# EAGLE design Shield Arduino Drone 1 (EAGLE 9.5.2)
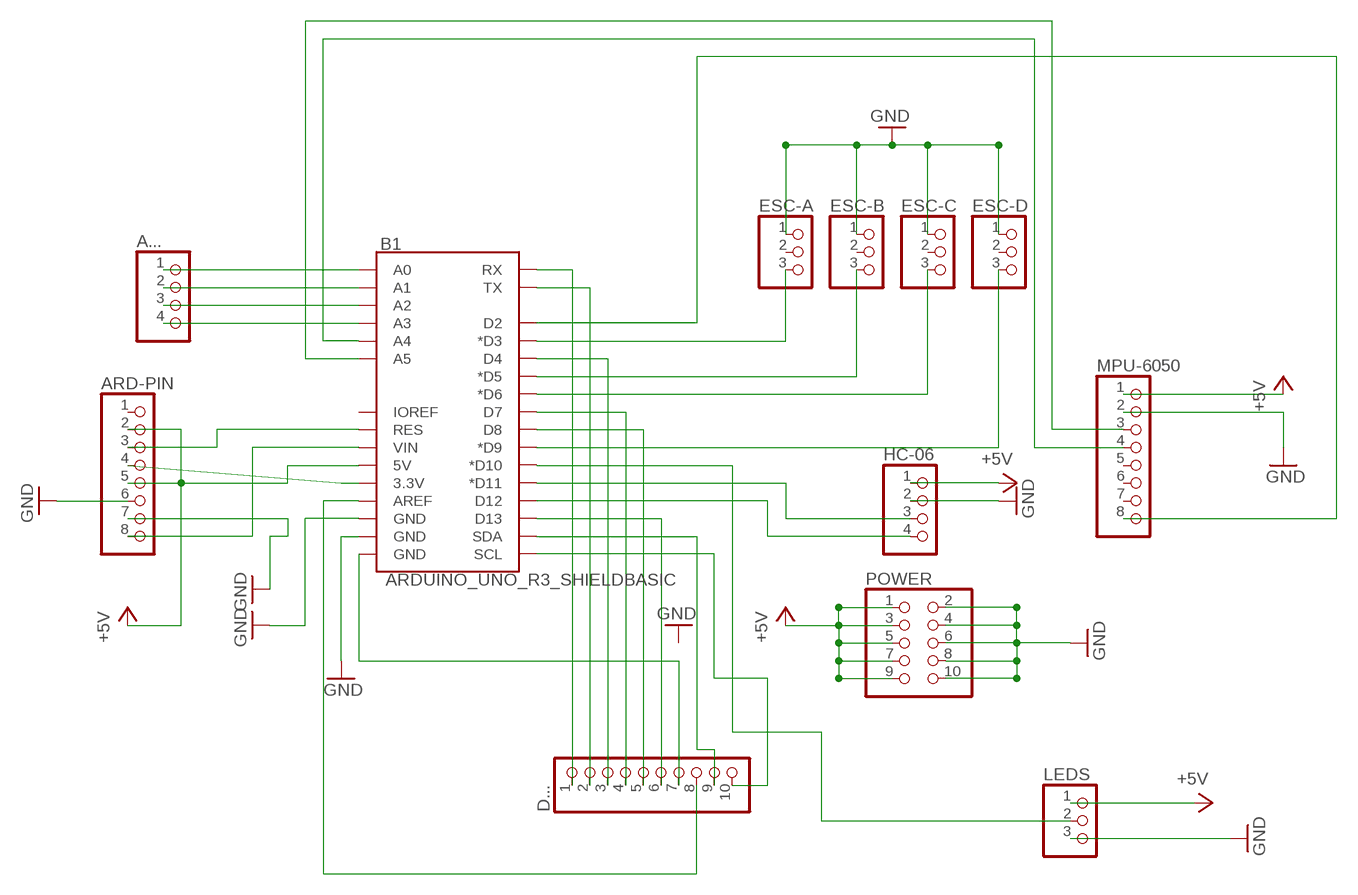
[diagram p0: schematic, sheet 1]

## Parts
A...  PINHD-1X4  [1X04]
ARD-PIN  PINHD-1X8  [1X08]
B1  ARDUINO_UNO_R3_SHIELDBASIC  [UNO_R3_SHIELD]
D...  PINHD-1X10  [1X10]
ESC-A  PINHD-1X3  [1X03]
ESC-B  PINHD-1X3  [1X03]
ESC-C  PINHD-1X3  [1X03]
ESC-D  PINHD-1X3  [1X03]
HC-06  PINHD-1X4  [1X04]
LEDS  PINHD-1X3  [1X03]
MPU-6050  PINHD-1X8  [1X08]
POWER  PINHD-2X5  [2X05]

## Nets
+5V [Power]: ARD-PIN.2 ARD-PIN.5 B1.5V HC-06.1 LEDS.1 MPU-6050.1 POWER.1 POWER.3 POWER.5 POWER.7 POWER.9
GND [Power]: ARD-PIN.6 ARD-PIN.7 B1.GND@1(GND) B1.GND@2(GND) ESC-A.1 ESC-B.1 ESC-C.1 ESC-D.1 HC-06.2 LEDS.3 MPU-6050.2 POWER.2 POWER.4 POWER.6 POWER.8 POWER.10
N$1: B1.A5 MPU-6050.3
N$2: B1.A4 MPU-6050.4
N$3: B1.D2 MPU-6050.8
N$4: B1.D11(*D11) HC-06.3
N$5: B1.D12 HC-06.4
N$6: A....1 B1.A0
N$7: A....2 B1.A1
N$8: A....3 B1.A2
N$9: A....4 B1.A3
N$10: ARD-PIN.8 B1.VIN
N$11: ARD-PIN.3 B1.RES
N$12: B1.D13 D....6
N$13: B1.RX D....1
N$15: ARD-PIN.4 B1.3.3V
N$16: B1.TX D....2
N$17: B1.D3(*D3) ESC-A.3
N$18: B1.D4 D....3
N$19: B1.D5(*D5) ESC-B.3
N$20: B1.D6(*D6) ESC-C.3
N$21: B1.D7 D....4
N$22: B1.D8 D....5
N$23: B1.D9(*D9) ESC-D.3
N$24: B1.D10(*D10) LEDS.2
N$25: B1.AREF D....8
N$26: B1.SDA D....9
N$27: B1.SCL D....10
N$29: B1.GND@0(GND) D....7
Unconnected: ARD-PIN.1 B1.IOREF ESC-A.2 ESC-B.2 ESC-C.2 ESC-D.2 MPU-6050.5 MPU-6050.6 MPU-6050.7

## Library data of the parts
A... HC-06 = pinhead:PINHD-1X4: PIN HEADER
ARD-PIN MPU-6050 = pinhead:PINHD-1X8: PIN HEADER
B1 = SparkFun-Boards:ARDUINO_UNO_R3_SHIELD: Arduino R3 Shield Footprint Shield form compatible with the Arduino Uno R3. SparkFun Products: MG2639 Cellular Shield <https://www.sparkfun.com/products/13120> MIDI Shield <https://www.sparkfun.com/products/12898> R3 Stackable Headers Kit <https://www.sparkfun.com/products/11417>
D... = pinhead:PINHD-1X10: PIN HEADER
ESC-A ESC-B ESC-C ESC-D LEDS = pinhead:PINHD-1X3: PIN HEADER
POWER = pinhead:PINHD-2X5: PIN HEADER

## Net classes
0 default: width 0.305 mm, drill 0.254 mm
1 Power: width 0.762 mm, drill 0.305 mm

## Board
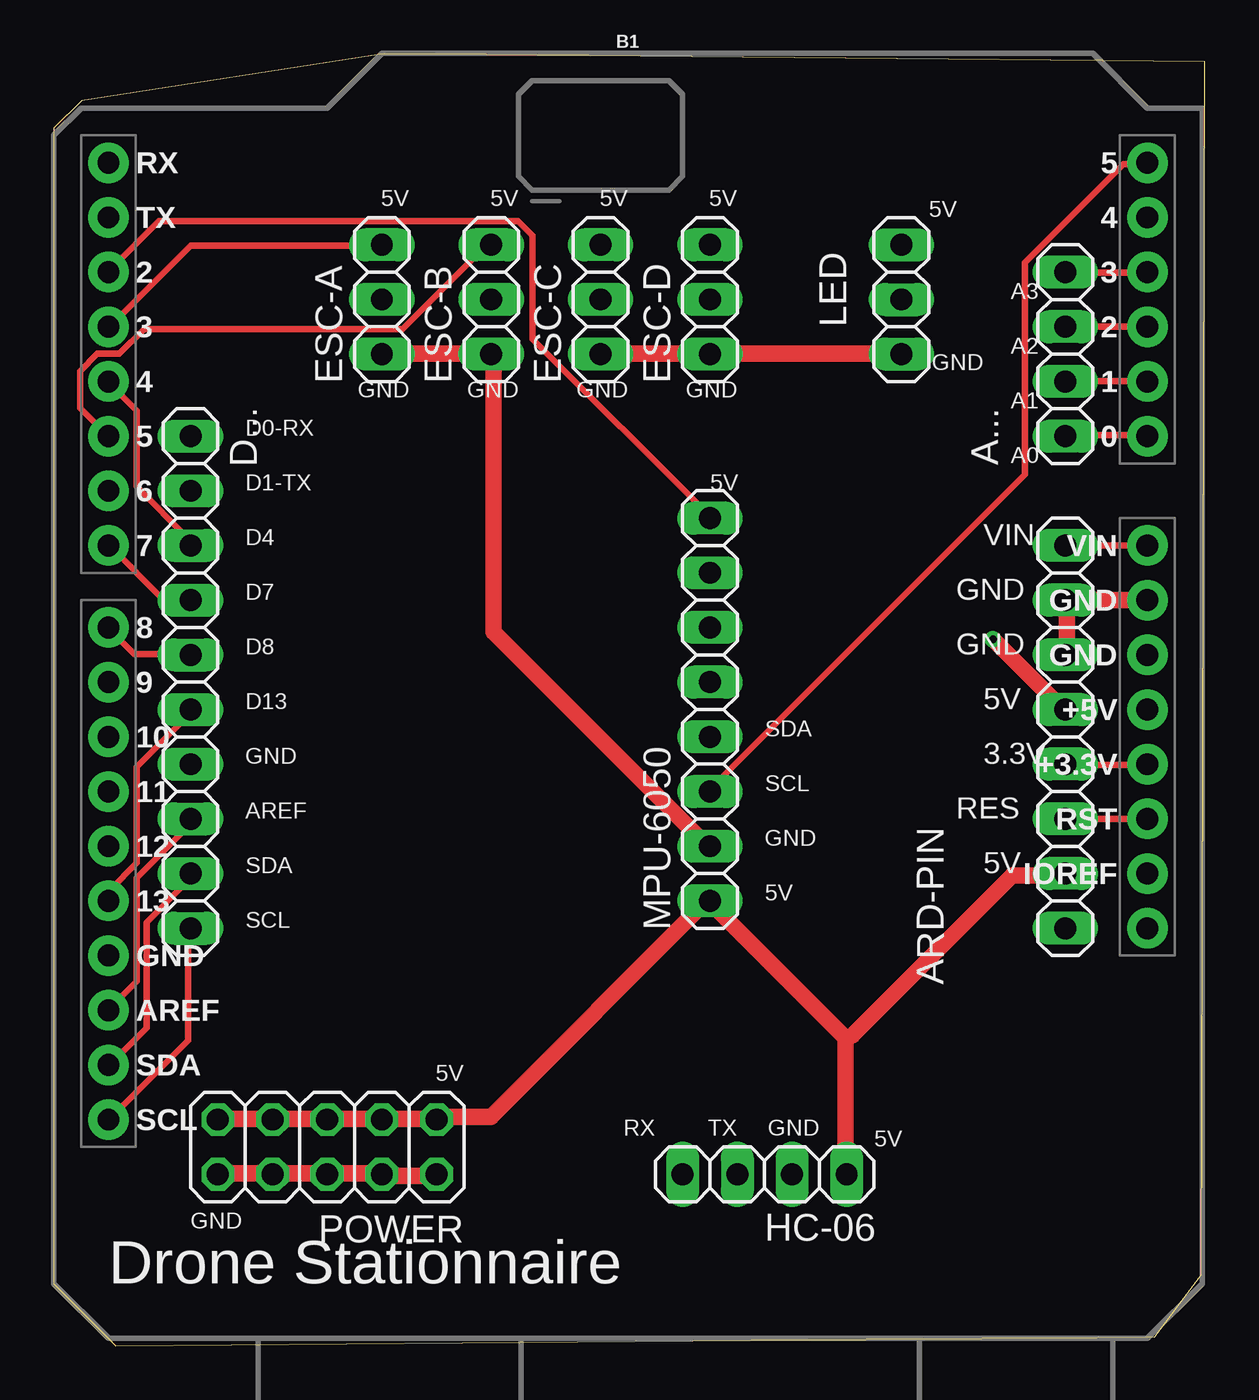
[diagram p1: board, top side]
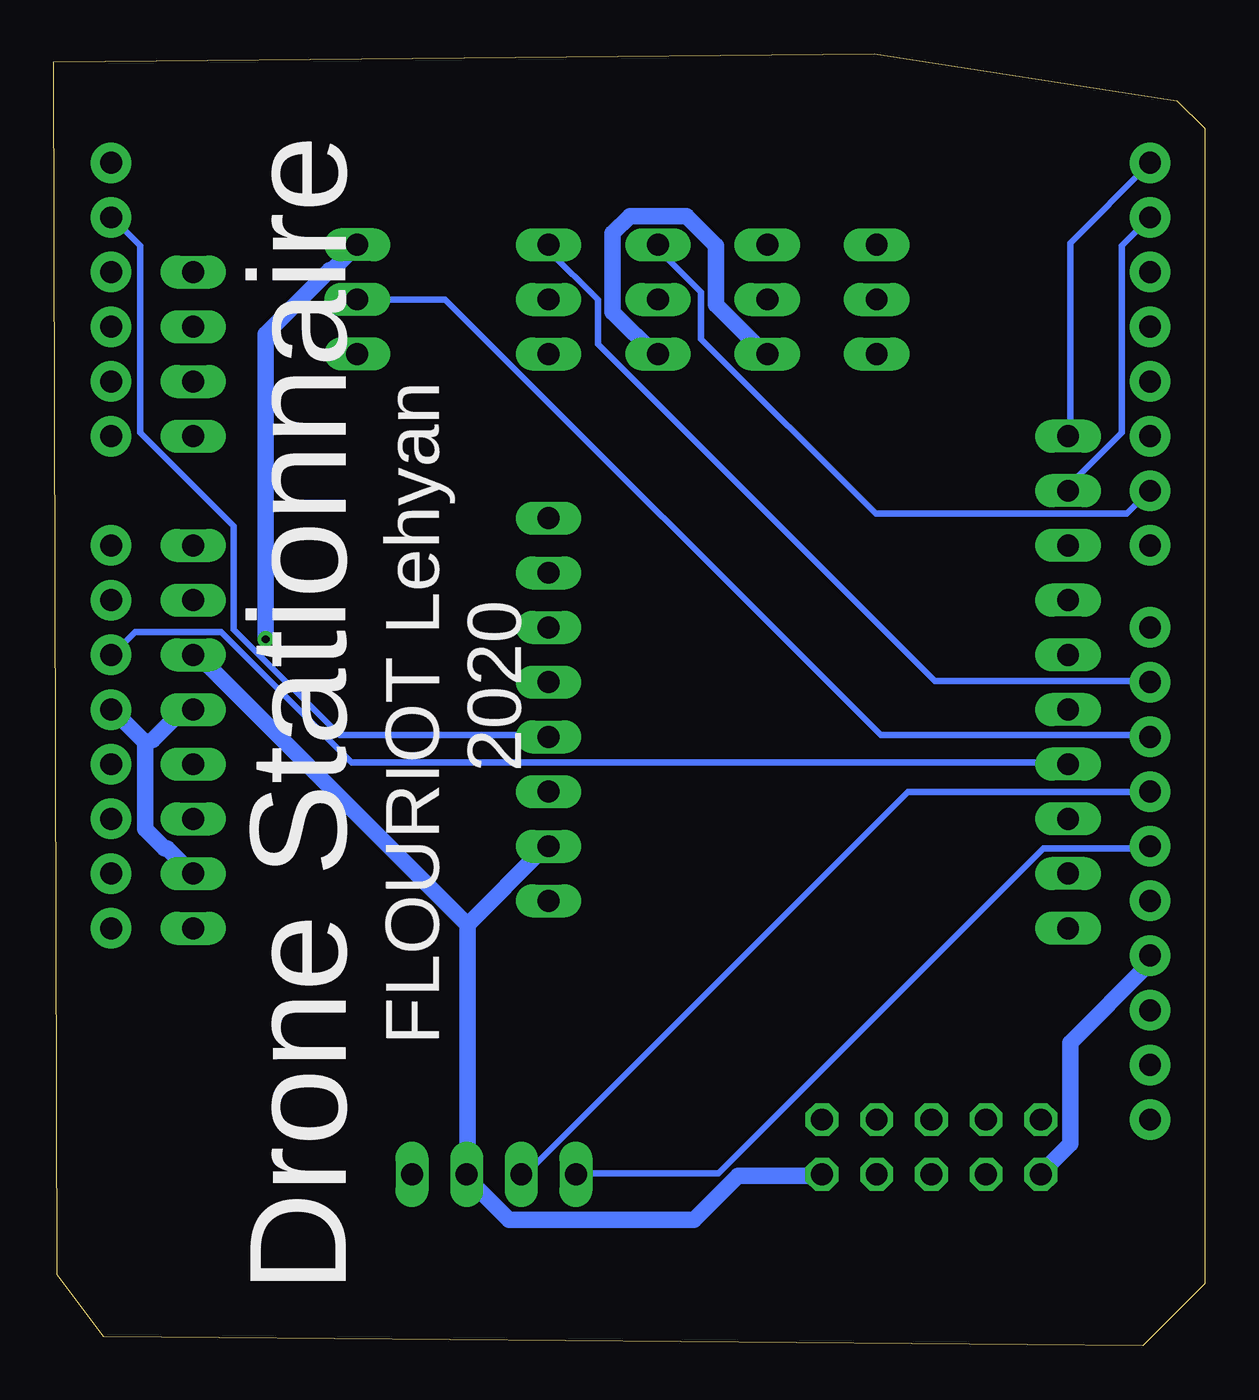
[diagram p2: board, bottom side, seen from below]

Size 53.47 x 60.01 mm. Coordinates in mm from the lower left corner, seen from the top.
Outline: 0,56.55 0,2.88 2.88,0 51.14,0.41 53.3,3.3 53.46,59.64 15.35,60.01 1.29,57.82 0,56.55
Copper layers (1*16): Top 0.035mm / dielectric 1.5mm / Bottom 0.035mm
Design rules "default": minimum track width 6mil, minimum drill 0.35mm, track to track 6mil, track to pad 6mil, pad to pad 6mil, via to via 6mil, smd to smd 6mil, copper to edge 40mil, drill to drill 6mil, minimum pad ring 10mil, minimum via ring 8mil, stop-mask expansion 4mil, vias tented up to drill 0mil, thermal gap 10mil

### Footprints (pad centres in the part's own frame; a part is rotated, then mirrored left to right if it is on the bottom)
1X04 = drill 1.016 long: 1 -3.81,0; 2 -1.27,0; 3 1.27,0; 4 3.81,0
1X08 = drill 1.016 long: 1 -8.89,0; 2 -6.35,0; 3 -3.81,0; 4 -1.27,0; 5 1.27,0; 6 3.81,0; 7 6.35,0; 8 8.89,0
UNO_R3_SHIELD = drill 1.016 pad 1.88: 3.3V 24.13,-2.54; 5V 24.13,0; A0 24.13,12.7; A1 24.13,15.24; A2 24.13,17.78; A3 24.13,20.32; A4 24.13,22.86; A5 24.13,25.4; AREF -24.13,-13.97; D2 -24.13,20.32; D3 -24.13,17.78; D4 -24.13,15.24; D5 -24.13,12.7; D6 -24.13,10.16; D7 -24.13,7.62; D8 -24.13,3.81; D9 -24.13,1.27; D10 -24.13,-1.27; D11 -24.13,-3.81; D12 -24.13,-6.35; D13 -24.13,-8.89; GND@0 24.13,2.54; GND@1 24.13,5.08; GND@2 -24.13,-11.43; IOREF 24.13,-7.62; NC 24.13,-10.16; RES 24.13,-5.08; RX -24.13,25.4; SCL -24.13,-19.05; SDA -24.13,-16.51; TX -24.13,22.86; VIN 24.13,7.62
1X10 = drill 1.016 long: 1 -11.43,0; 2 -8.89,0; 3 -6.35,0; 4 -3.81,0; 5 -1.27,0; 6 1.27,0; 7 3.81,0; 8 6.35,0; 9 8.89,0; 10 11.43,0
1X03 = drill 1.016 long: 1 -2.54,0; 2 0,0; 3 2.54,0
2X05 = drill 1.016 octagon: 1 -5.08,-1.27; 2 -5.08,1.27; 3 -2.54,-1.27; 4 -2.54,1.27; 5 0,-1.27; 6 0,1.27; 7 2.54,-1.27; 8 2.54,1.27; 9 5.08,-1.27; 10 5.08,1.27

### Placement (x,y rotation side)
A...  46.99,46.06 90 top
ARD-PIN  46.99,28.28 90 top
B1  26.67,29.55 0 top
D...  6.35,30.82 270 top
ESC-A  15.24,48.6 90 top
ESC-B  20.32,48.6 90 top
ESC-C  25.4,48.6 90 top
ESC-D  30.48,48.6 90 top
HC-06  33.02,7.96 180 top
LEDS  39.37,48.6 270 top
MPU-6050  30.48,29.55 90 top
POWER  12.7,9.23 180 top

### Tracks (layer width: path | path; a pad name or v marks a point on that pad's centre or on a via)
+5V  (via drill 0.35)
  Top 0.762: v43.62,32.82 46.94,29.5 ARD-PIN.5 | POWER.9 7.62,10.53 10.13,10.53 POWER.7 10.48,10.53 12.65,10.53 POWER.5 12.99,10.53 15.16,10.53 POWER.3 15.62,10.53 17.68,10.53 POWER.1 18.14,10.64 20.31,10.64 30.14,20.47 MPU-6050.1 30.48,20.59 36.77,14.3 | 36.77,14.3 36.77,8.01 HC-06.1 | ARD-PIN.2 46.94,21.84 44.54,21.84 37.11,14.41 36.77,14.3
  Bottom 0.762: 49.23,28.01 49.23,24.01 48.31,23.1 48.2,23.1 47.05,21.96 ARD-PIN.2 | 49.23,28.01 50.71,29.5 B1.5V | ARD-PIN.5 47.05,29.5 47.51,29.5 48.88,28.13 49.23,28.01 | v43.62,32.82 43.62,46.99 40.65,49.96 40.54,49.96 39.39,51.1 LEDS.1
GND
  Top 0.762: ESC-A.1 15.28,46.07 20.31,46.07 ESC-B.1 20.42,45.73 20.42,33.16 30.48,23.1 MPU-6050.2 | ESC-C.1 25.45,46.07 30.48,46.07 ESC-D.1 30.82,46.07 39.28,46.07 LEDS.3 | POWER.10 7.62,8.01 10.13,8.01 POWER.8 10.48,8.01 12.65,8.01 POWER.6 12.99,8.01 15.16,8.01 POWER.4 15.62,7.9 17.68,7.9 POWER.2 | ARD-PIN.6 47.05,32.13 47.05,34.53 ARD-PIN.7 47.4,34.64 50.71,34.64 B1.GND@1
  Bottom 0.762: ESC-B.1 20.42,46.07 22.71,48.36 22.71,51.1 24.08,52.48 26.71,52.48 27.51,51.67 27.51,48.02 25.45,45.96 ESC-C.1 | B1.GND@2 2.59,18.07 2.59,17.73 6.25,14.07 6.25,9.38 7.62,8.01 POWER.10 | 34.25,19.56 34.25,8.01 HC-06.2 34.14,7.67 32.31,5.84 23.74,5.84 21.68,7.9 17.79,7.9 POWER.2 | 34.25,19.56 30.71,23.1 30.48,23.1 MPU-6050.2 | 34.25,19.56 46.71,32.02 46.94,32.02 ARD-PIN.6
N$1
  Top 0.305: MPU-6050.3 30.48,25.84 45.11,40.47 45.11,50.3 49.68,54.88 50.71,54.88 B1.A5
N$2
  Bottom 0.305: MPU-6050.4 30.48,28.36 40.2,28.36 45.11,33.27 45.11,38.07 49.45,42.42 49.45,51.1 50.71,52.36 B1.A4
N$3
  Top 0.305: MPU-6050.8 30.48,38.53 22.25,46.76 22.25,51.56 21.56,52.25 4.88,52.25 2.59,49.96 B1.D2
N$4
  Bottom 0.305: HC-06.3 31.74,8.01 31.51,8.01 13.79,25.73 2.59,25.73 B1.D11
N$5
  Bottom 0.305: HC-06.4 29.11,8.01 22.59,8.01 7.51,23.1 2.59,23.1 B1.D12
N$6
  Top 0.305: A....1 47.05,42.3 50.71,42.3 B1.A0
N$7
  Top 0.305: A....2 47.05,44.82 50.71,44.82 B1.A1
N$8
  Top 0.305: B1.A2 A....3
N$9
  Top 0.305: A....4 47.05,49.85 50.71,49.85 B1.A3
N$10
  Top 0.305: ARD-PIN.8 47.05,37.16 50.71,37.16 B1.VIN
N$11
  Top 0.305: B1.RES ARD-PIN.3
N$12
  Top 0.305: D....6 6.25,29.5 6.25,29.27 3.85,26.87 3.85,22.41 2.59,21.16 2.59,20.7 B1.D13
N$13
  Bottom 0.305: D....1 6.25,42.3 6.25,51.22 2.59,54.88 B1.RX
N$15
  Top 0.305: ARD-PIN.4 47.05,26.99 50.71,26.99 B1.3.3V
N$16
  Bottom 0.305: B1.TX 3.85,51.1 3.85,42.42 6.25,40.02 6.25,39.79 D....2
N$17
  Top 0.305: ESC-A.3 15.16,51.1 6.36,51.1 2.59,47.33 B1.D3
N$18
  Top 0.305: D....3 6.25,37.27 6.25,37.5 3.85,39.9 3.85,43.45 2.59,44.7 B1.D4
N$19
  Top 0.305: ESC-B.3 20.31,51.1 20.08,51.1 16.19,47.22 4.19,47.22 3.05,46.07 2.02,46.07 1.22,45.27 1.22,43.56 2.48,42.3 B1.D5
N$20
  Bottom 0.305: ESC-C.3 25.34,51.1 25.34,50.87 23.39,48.93 23.39,46.76 15.28,38.64 3.62,38.64 2.59,39.67 B1.D6
N$21
  Top 0.305: D....4 6.25,34.64 5.1,34.64 2.59,37.16 B1.D7
N$22
  Top 0.305: D....5 6.25,32.13 3.73,32.13 2.59,33.27 B1.D8
N$23
  Bottom 0.305: ESC-D.3 30.48,50.87 28.19,48.59 28.19,46.53 12.53,30.87 2.59,30.87 B1.D9
N$24
  Bottom 0.305: LEDS.2 39.28,48.59 35.28,48.59 15.05,28.36 2.59,28.36 B1.D10
N$25
  Top 0.305: D....8 6.25,24.47 6.25,24.13 3.85,21.73 3.85,16.93 2.59,15.67 B1.AREF
N$26
  Top 0.305: D....9 6.25,21.84 6.25,21.61 4.31,19.67 4.31,14.76 2.59,13.04 B1.SDA
N$27
  Top 0.305: D....10 6.25,19.33 6.25,14.18 2.59,10.53 B1.SCL
N$29
  Bottom 0.305: D....7 6.36,27.1 39.62,27.1 45.68,33.16 49.68,33.16 50.71,32.13 B1.GND@0

### Text on the board
tPlace: 5V | 5V | 5V | 5V | 5V | A3 | LED | GND | A2 | GND | GND | GND | GND | A1 | D0-RX | A0 | D1-TX | 5V | D4 | VIN | D7 | GND | D8 | GND | D13 | 5V | SDA | GND | 3.3V | SCL | AREF | RES | GND | SDA | 5V | 5V | SCL | 5V | RX | TX | GND | 5V | GND | Drone Stationnaire
bPlace: Drone Stationnaire | FLOURIOT Lehyan | 2020